# Altium schematic sheet button.SchDoc
size A
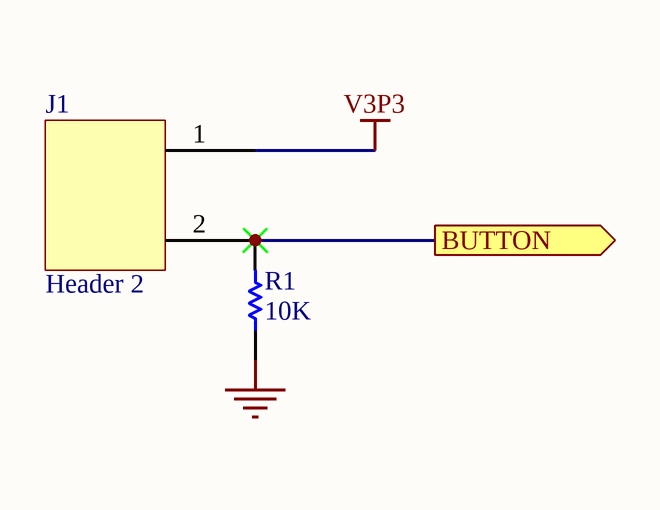
[diagram p0: button.SchDoc]

## Parts
J1  Header 2  [Header 2 BUTTON]
R1  10K  [Resistor]

## Ports
BUTTON (out)

## Nets
GND: R1.1
V3P3: J1.1
BUTTON: J1.2 R1.2 ; port BUTTON

## Library data of the parts
J1 = Header 2: Fabricant: MULTICOMP; Ref. Fabricant: 2211S-02G; Fournisseur: Farnell; Ref. Fournisseur: 1593411
R1 = Res1: Resistor; Published: 8-Jun-2000; LatestRevisionDate: 17-Jul-2002; LatestRevisionNote: Re-released for DXP Platform.; PackageReference: AXIAL-0.3; Publisher: Altium Limited; PackageDescription: Axial Device, Thru-Hole; 2 Leads; 0.3 in Pin Spacing; Value: 10K